# EAGLE design icetube_main (EAGLE 6.4)
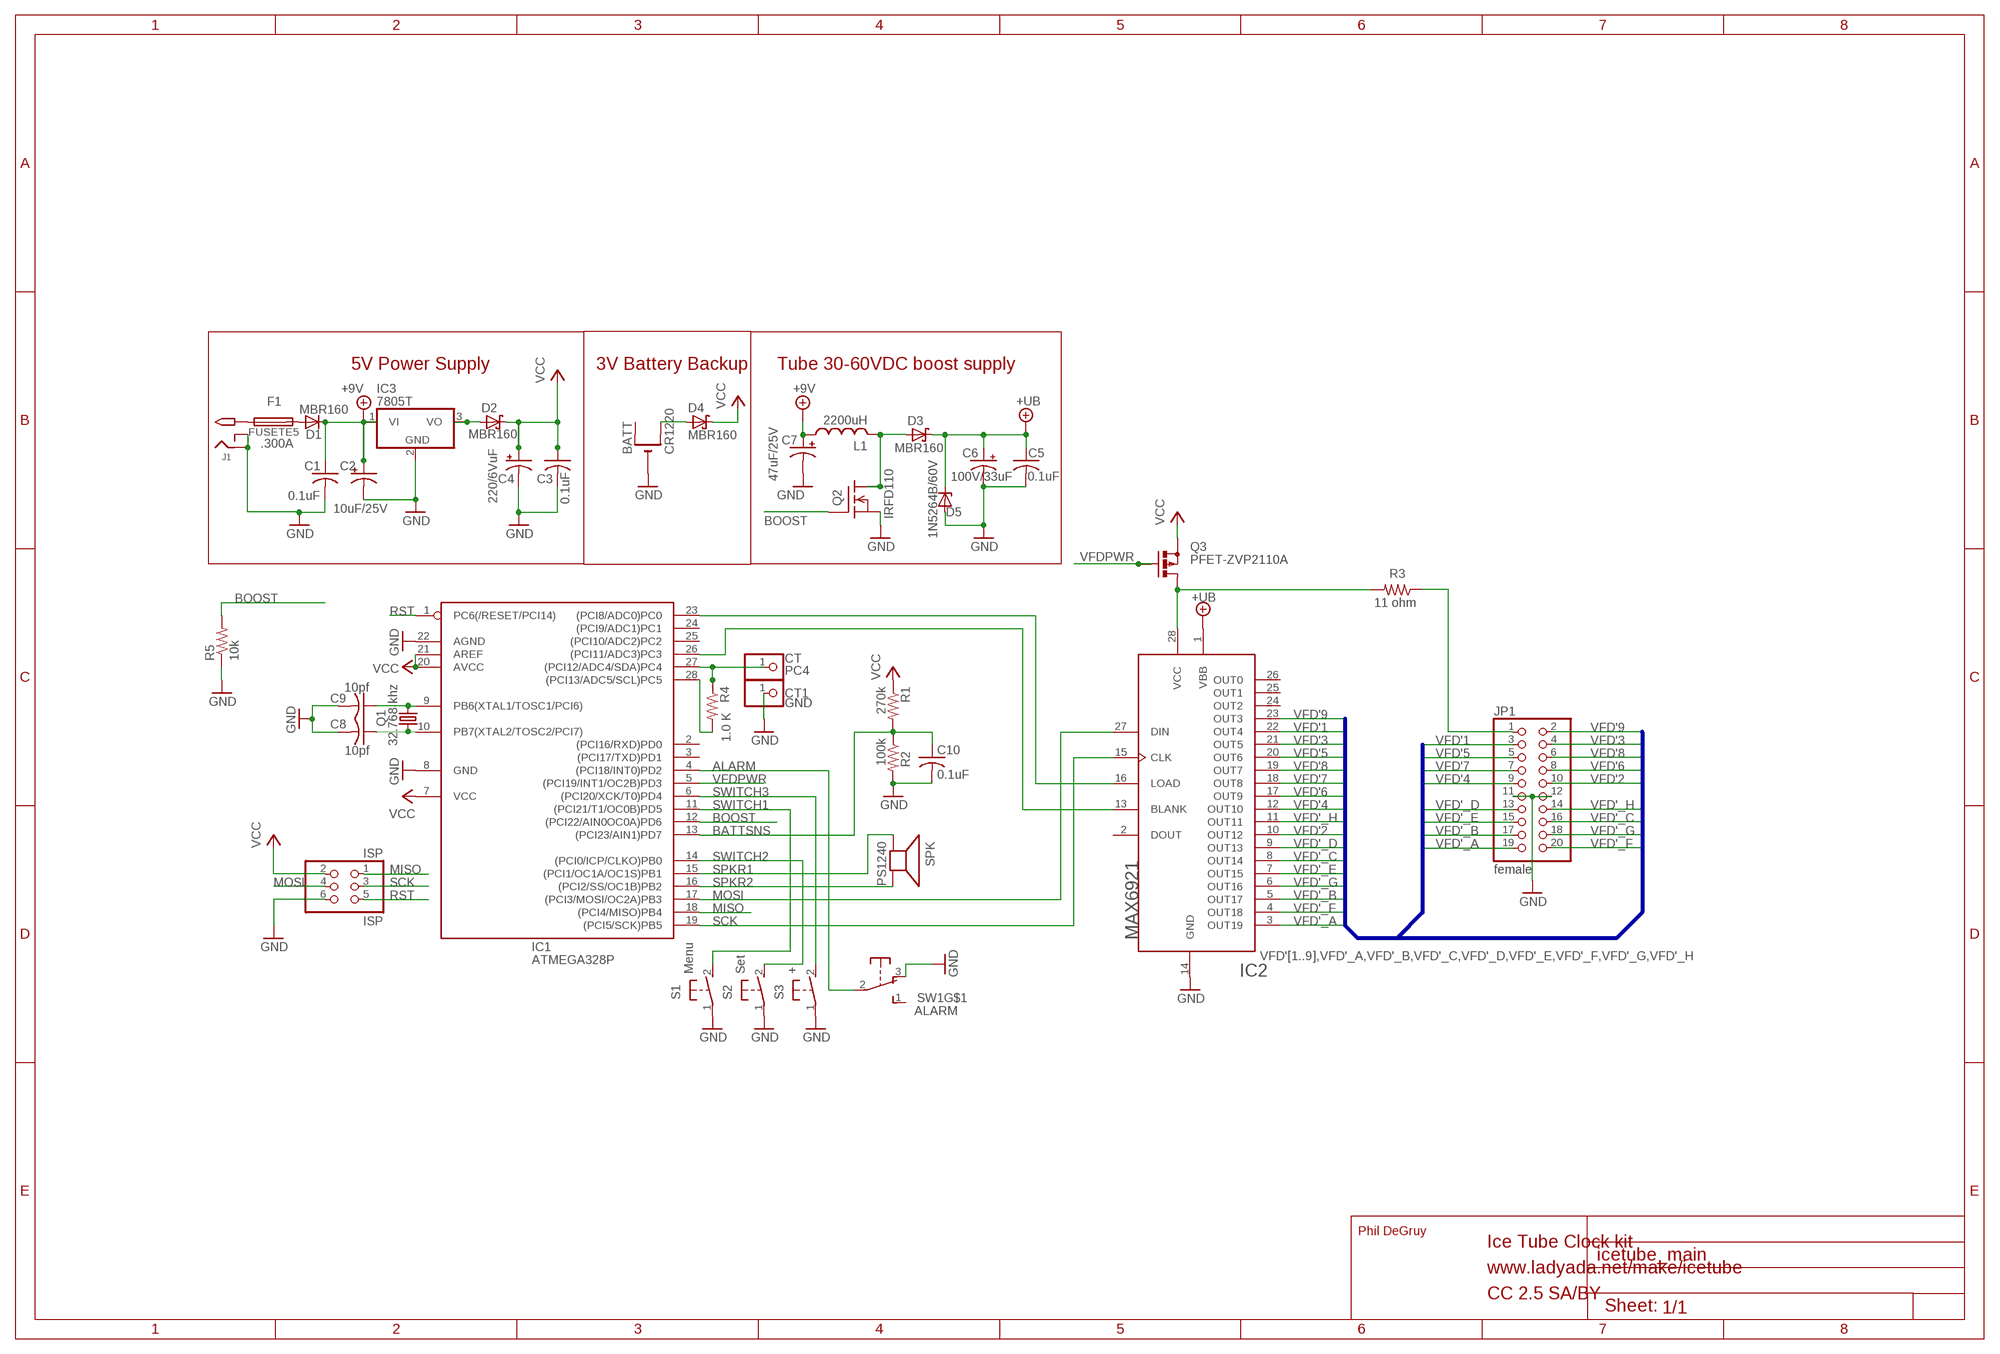
[diagram p0: schematic, sheet 1]

## Parts
BATT  CR1220  CR1220THM  [CR1220-THM]
C1  0.1uF  C-US025-025X050  [C025-025X050]
C2  10uF/25V  CPOL-USE2.5-6  [E2,5-6]
C3  0.1uF  C-US025-025X050  [C025-025X050]
C4  220/6VuF  CPOL-USE2.5-6  [E2,5-6]
C5  0.1uF  C-US025-024X044  [C025-024X044]
C6  100V/33uF  CPOL-USE3.5-8  [E3,5-8]
C7  47uF/25V  CPOL-USE2.5-6  [E2,5-6]
C8  10pf  C-US025-025X050  [C025-025X050]
C9  10pf  C-US025-025X050  [C025-025X050]
C10  0.1uF  C-US025-024X044  [C025-024X044]
CT  PC4  PINHD-1X1  [1X01]
CT1  GND  PINHD-1X1  [1X01]
D1  MBR160  1N4004  [DO41-10]
D2  MBR160  SCHOTTKY-DIODEDO41  [DO41-10]
D3  MBR160  SCHOTTKY-DIODEDO41  [DO41-10]
D4  MBR160  SCHOTTKY-DIODEDO41  [DO41-10]
D5  1N5264B/60V  ZENER-DIODEDO41Z10  [DO41Z10]
F1  FUSETE5  [TE5]
IC1  ATMEGA328P  ATMEGA168PROUND  [DIL28/3]
IC2  MAX6921  [PLCC-S28]
IC3  7805T  [TO220H]
ISP  ISP  PINHD-2X3  [2X03]
J1  2.1MMJACKTHM  [PJ-102A]
JP1  female  PINHD-2X10  [2X10]
L1  2200uH  L  [6000]
Q1  32.768 khz  CRYTALTC26V  [TC26V]
Q2  IRFD110  [DIL04]
Q3  PFET-ZVP2110A  PFETZVP3306  [TO92-OVAL]
R1  270k  R-US_0207/10  [0207/10]
R2  100k  R-US_0207/10  [0207/10]
R3  11 ohm  R-US_0207/10  [0207/10]
R4  1.0 K  R-US_0207/5V  [0207/5V]
R5  10k  R-US_0207/5V  [0207/5V]
S1  Menu  31-XX  [B3F-31XX]
S2  Set  31-XX  [B3F-31XX]
S3  +  31-XX  [B3F-31XX]
SPK  PS1240  SPEAKER/PS12  [PS12]
SW1  ALARM  OS102011MA1Q  [OS102011MA1Q]

## Nets
+9V: C1.1 C2.+ C7.+ D1.C IC3.1(VI) L1.1
+UB: C5.1 C6.+ D3.C D5.C IC2.1(VBB)
ALARM: IC1.4((PCI18/INT0)PD2) SW1.2(P)
BATTSNS: C10.1 IC1.13((PCI23/AIN1)PD7) R1.2 R2.1
BLANK: IC1.26((PCI11/ADC3)PC3) IC2.13(BLANK)
BOOST: IC1.12((PCI22/AIN0OC0A)PD6) Q2.3(G) R5.2
GND: BATT.- C1.2 C2.- C3.2 C4.- C5.2 C6.- C7.- C8.2 C9.2 C10.2 CT1.1 D5.A IC1.8(GND) IC1.22(AGND) IC2.14(GND) IC3.2(GND) ISP.6 J1.RING J1.RING_SW JP1.11 JP1.12 Q2.4(S) R2.2 R5.1 S1.1(P) S2.1(P) S3.1(P) SW1.3(O)
LOAD: IC1.23((PCI8/ADC0)PC0) IC2.16(LOAD)
MISO: IC1.18((PCI4/MISO)PB4) ISP.1
MOSI: IC1.17((PCI3/MOSI/OC2A)PB3) IC2.27(DIN) ISP.4
N$1: C9.1 IC1.9(PB6(XTAL1/TOSC1/PCI6)) Q1.2
N$2: D3.A L1.2 Q2.1(D) Q2.2(D1)
N$3: C8.1 IC1.10(PB7(XTAL2/TOSC2/PCI7)) Q1.1
N$4: F1.1 J1.TIP
N$5: D1.A F1.2
N$10: BATT.+2(+1) D4.A
N$11: IC1.28((PCI13/ADC5/SCL)PC5) R4.2
N$34: JP1.1 R3.1
N$39: IC2.28(VCC) Q3.3(D) R3.2
N$52: CT.1 IC1.27((PCI12/ADC4/SDA)PC4) R4.1
N$53: D2.A IC3.3(VO)
RST: IC1.1(PC6(/RESET/PCI14)) ISP.5
SCK: IC1.19((PCI5/SCK)PB5) IC2.15(CLK) ISP.3
SPKR1: IC1.15((PCI1/OC1A/OC1S)PB1) SPK.P$1(+)
SPKR2: IC1.16((PCI2/SS/OC1B)PB2) SPK.P$2(-)
SWITCH1: IC1.11((PCI21/T1/OC0B)PD5) S1.2(S)
SWITCH2: IC1.14((PCI0/ICP/CLKO)PB0) S2.2(S)
SWITCH3: IC1.6((PCI20/XCK/T0)PD4) S3.2(S)
VCC: C3.1 C4.+ D2.C D4.C IC1.7(VCC) IC1.20(AVCC) IC1.21(AREF) ISP.2 Q3.1(S) R1.1
VFD'1: IC2.22(OUT4) JP1.3
VFD'2: IC2.10(OUT12) JP1.10
VFD'3: IC2.21(OUT5) JP1.4
VFD'4: IC2.12(OUT10) JP1.9
VFD'5: IC2.20(OUT6) JP1.5
VFD'6: IC2.17(OUT9) JP1.8
VFD'7: IC2.18(OUT8) JP1.7
VFD'8: IC2.19(OUT7) JP1.6
VFD'9: IC2.23(OUT3) JP1.2
VFD'_A: IC2.3(OUT19) JP1.19
VFD'_B: IC2.5(OUT17) JP1.17
VFD'_C: IC2.8(OUT14) JP1.16
VFD'_D: IC2.9(OUT13) JP1.13
VFD'_E: IC2.7(OUT15) JP1.15
VFD'_F: IC2.4(OUT18) JP1.20
VFD'_G: IC2.6(OUT16) JP1.18
VFD'_H: IC2.11(OUT11) JP1.14
VFDPWR: IC1.5((PCI19/INT1/OC2B)PD3) Q3.2(G)
Unconnected: BATT.+1(+) IC1.2((PCI16/RXD)PD0) IC1.3((PCI17/TXD)PD1) IC1.24((PCI9/ADC1)PC1) IC1.25((PCI10/ADC2)PC2) IC2.2(DOUT) IC2.24(OUT2) IC2.25(OUT1) IC2.26(OUT0) SW1.1(S) SW1.MT1(MT) SW1.MT2(MT)

## Buses
VFD'[1..9],VFD'_A,VFD'_B,VFD'_C,VFD'_D,VFD'_E,VFD'_F,VFD'_G,VFD'_H

## Notes on the sheet
- 5V Power Supply | 3V Battery Backup | Tube 30-60VDC boost supply
- Ice Tube Clock kit
- www.ladyada.net/make/icetube
- CC 2.5 SA/BY

## Library data of the parts
BATT = adafruit:CR1220: CR1216/CR1220/CR1225 12mm 3V lithium coin cell Great for battery packup. Both SMT and THM holders. Note the THM package has the ground pads on both sides of the PCB so that the masks are the same - this reduces the cost
C1 C3 C8 C9 = minimidi:C-US: CAPACITOR, American symbol
C2 C4 C7 = minimidi:CPOL-US: POLARIZED CAPACITOR, American symbol
C5 C10 = rcl-ez:C-US: CAPACITOR, American symbol
C6 = rcl-ez:CPOL-US: POLARIZED CAPACITOR, American symbol
CT CT1 = ybox2:PINHD-1X1: PIN HEADER
D1 = minimidi:1N4004: DIODE general purpose rectifier, 1 A
D2-D4 = usbbuck:SCHOTTKY-DIODE: Schottky Diode
D5 = diode:ZENER-DIODE: Z-Diode
F1 = fuse:FUSE: Fuse; MF: .300A; OC_FARNELL: unknown; OC_NEWARK: unknown
IC1 = avr:ATMEGA168*P: MICROCONTROLLER 16 kBytes FLASH 1 kBytes SRAM 512 Bytes EEPROM USART 8-channel 10 bit ADC
IC2 = vfd:MAX6921
IC3 = linear:78*: Positive VOLTAGE REGULATOR Source: http://cache.national.com/ds/LM/LM78L05.pdf http://www.fairchildsemi.com/ds/LM/LM7805.pdf
ISP = pinhead-ez:PINHD-2X3: PIN HEADER
J1 = adafruit:2.1MMJACK: 2.1mm x 5.5mm THM DC jack with internal switch. Digikey part #PJ-102A, 4UCON part #05537 2.1mm x 5.5mm SMT DC jack with internal switch. Digikey part #PJ-002A-SMT, 4UCON part #03267 By microbuilder.eu & adafruit.com
JP1 = pinhead:PINHD-2X10: PIN HEADER
L1 = usbbuck:L
Q1 = crystal:CRYTAL: CRYSTAL
Q2 = vfd:IRFD110
Q3 = adafruit:PFET: P-CHANNEL MOS FET
R1-R5 = minimidi:R-US_: RESISTOR, American symbol
S1-S3 = switch-omron:31-XX: OMRON SWITCH; MPN: B3F-3100; OC_FARNELL: 959704; OC_NEWARK: 36M3582
SPK = ybox2:SPEAKER: SPEAKER Source: Buerklin
SW1 = adafruit:OS102011MA1Q: OS10201MA1Q through-hole right angle switch http://www.ladyada.net/library/eagle

## Board
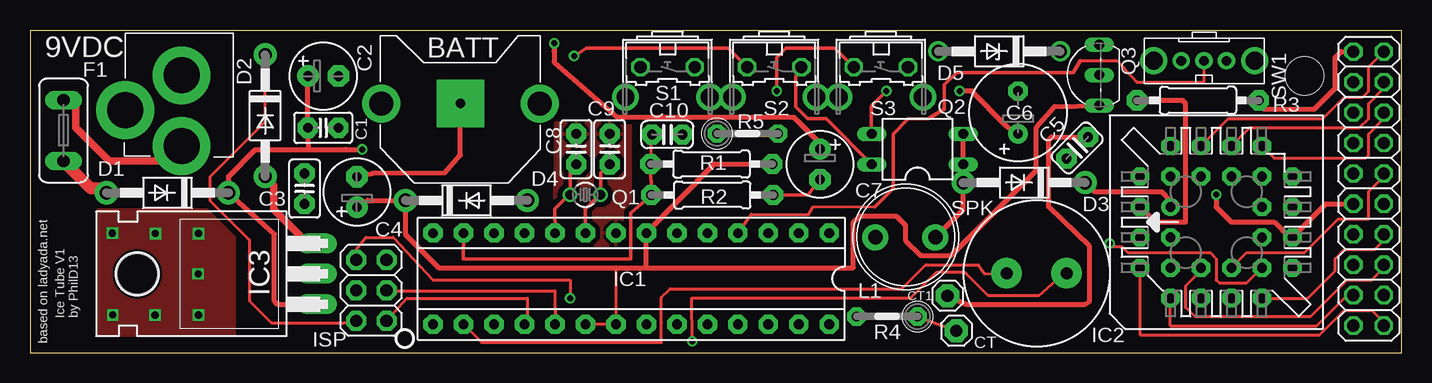
[diagram p1: board, top side]
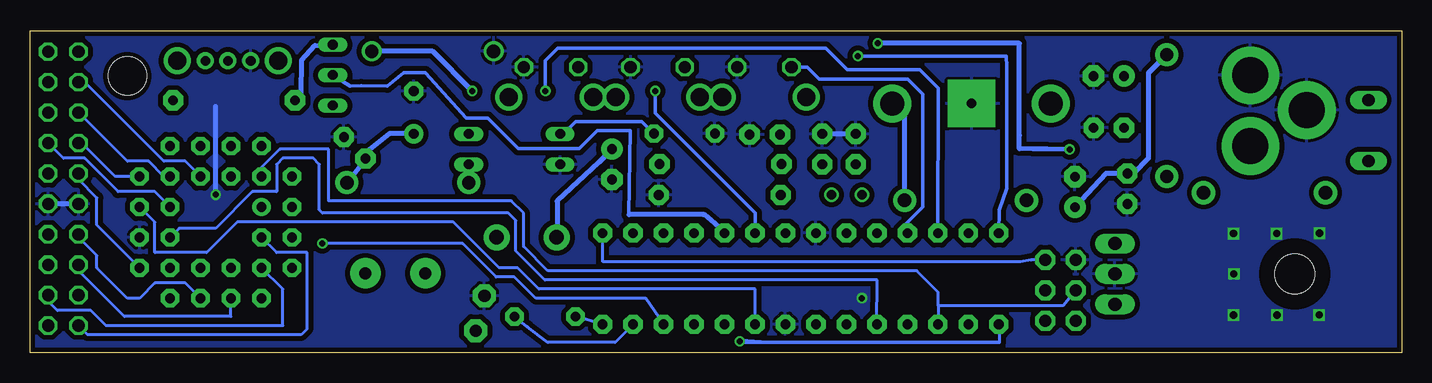
[diagram p2: board, bottom side, seen from below]

Size 114.33 x 26.86 mm. Coordinates in mm from the lower left corner, seen from the top.
Outline: 0,0.01 114.33,0
Outline: 114.33,0 114.33,26.86 0,26.86 0,0.01
Outline: 0,0.01 114.33,0
Copper layers (1*16): Top 0.0356mm / dielectric 1.5011mm / Bottom 0.0356mm
Design rules "osh_boards": minimum track width 6mil, minimum drill 13mil, track to track 6mil, track to pad 6mil, pad to pad 6mil, via to via 6mil, smd to smd 6mil, copper to edge 15mil, drill to drill 6mil, minimum pad ring 7mil, minimum via ring 7mil, stop-mask expansion 4mil, vias tented up to drill 0mil, thermal gap 10mil
Holes 3.2 mm at 106.22,23.09

### Footprints (pad centres in the part's own frame; a part is rotated, then mirrored left to right if it is on the bottom)
CR1220-THM = drill 2 pad 3.175: +1 -6.604,0; +2 6.604,0 | drill 0.8 pad 3.962 square: - 0,0
C025-025X050 = drill 0.813 pad 1.676 octagon: 1 -1.27,0; 2 1.27,0
E2,5-6 = drill 0.813 pad 1.778: + -1.27,0 | drill 0.813 pad 1.778 octagon: - 1.27,0
C025-024X044 = drill 0.813 pad 1.676 octagon: 1 -1.27,0; 2 1.27,0
E3,5-8 = drill 0.813 pad 1.6: + -1.778,0 | drill 0.813 pad 1.6 octagon: - 1.778,0
1X01 = drill 1.016 pad 1.93 octagon: 1 0,0
DO41-10 = drill 1.118 pad 1.93: A 5.08,0; C -5.08,0
DO41Z10 = drill 1.118: A 5.08,0; C -5.08,0
TE5 = drill 1.016 long: 1 -2.54,0; 2 2.54,0
DIL28/3 = drill 0.813 pad 1.6 octagon: 1 -16.51,-3.81; 2 -13.97,-3.81; 3 -11.43,-3.81; 4 -8.89,-3.81; 5 -6.35,-3.81; 6 -3.81,-3.81; 7 -1.27,-3.81; 8 1.27,-3.81; 9 3.81,-3.81; 10 6.35,-3.81; 11 8.89,-3.81; 12 11.43,-3.81; 13 13.97,-3.81; 14 16.51,-3.81; 15 16.51,3.81; 16 13.97,3.81; 17 11.43,3.81; 18 8.89,3.81; 19 6.35,3.81; 20 3.81,3.81; 21 1.27,3.81; 22 -1.27,3.81; 23 -3.81,3.81; 24 -6.35,3.81; 25 -8.89,3.81; 26 -11.43,3.81; 27 -13.97,3.81; 28 -16.51,3.81
PLCC-S28 = drill 0.813 pad 1.524: 1 1.27,3.81 | drill 0.813 pad 1.524 octagon: 2 -1.27,6.35; 3 -1.27,3.81; 4 -3.81,6.35; 5 -6.35,3.81; 6 -3.81,3.81; 7 -6.35,1.27; 8 -3.81,1.27; 9 -6.35,-1.27; 10 -3.81,-1.27; 11 -6.35,-3.81; 12 -3.81,-6.35; 13 -3.81,-3.81; 14 -1.27,-6.35; 15 -1.27,-3.81; 16 1.27,-6.35; 17 1.27,-3.81; 18 3.81,-6.35; 19 6.35,-3.81; 20 3.81,-3.81; 21 6.35,-1.27; 22 3.81,-1.27; 23 6.35,1.27; 24 3.81,1.27; 25 6.35,3.81; 26 3.81,6.35; 27 3.81,3.81; 28 1.27,6.35
TO220H = drill 1.118 long: 1 -2.54,-10.16; 2 0,-10.16; 3 2.54,-10.16 | hole 3.302: 0,4.826
2X03 = drill 1.016 pad 1.676 octagon: 1 -2.54,-1.27; 2 -2.54,1.27; 3 0,-1.27; 4 0,1.27; 5 2.54,-1.27; 6 2.54,1.27
PJ-102A = drill 3 pad 4.8: RING 0.1,-3.39; RING_SW -4.6,-6.29; TIP 0.1,-9.29
2X10 = drill 1.016 octagon: 1 -11.43,-1.27; 2 -11.43,1.27; 3 -8.89,-1.27; 4 -8.89,1.27; 5 -6.35,-1.27; 6 -6.35,1.27; 7 -3.81,-1.27; 8 -3.81,1.27; 9 -1.27,-1.27; 10 -1.27,1.27; 11 1.27,-1.27; 12 1.27,1.27; 13 3.81,-1.27; 14 3.81,1.27; 15 6.35,-1.27; 16 6.35,1.27; 17 8.89,-1.27; 18 8.89,1.27; 19 11.43,-1.27; 20 11.43,1.27
6000 = drill 1.2 pad 2.184: 1 -2.5,0; 2 2.5,0
TC26V = drill 0.813: 1 -1.27,0; 2 1.27,0
DIL04 = drill 0.813 long: 1 -1.27,-3.81; 2 1.27,-3.81; 3 1.27,3.81; 4 -1.27,3.81
TO92-OVAL = drill 0.813 long: 1 -2.54,0; 2 0,0; 3 2.54,0
0207/10 = drill 0.813 pad 1.676 octagon: 1 -5.08,0; 2 5.08,0
0207/5V = drill 0.813 pad 1.524 octagon: 1 -2.54,0; 2 2.54,0
B3F-31XX = drill 1.016 octagon: 1 -2.261,-1.245; 2 2.261,-1.245 | drill 1.499 pad 2.159: 3 -3.505,1.245; 4 3.505,1.245
PS12 = drill 1 pad 2.54: P$1 -2.5,0; P$2 2.5,0
OS102011MA1Q = drill 0.8 pad 1.422: 1 -1.873,0; 2 0,0; 3 1.9,0 | drill 1.5 pad 2.184: MT1 -4.227,0; MT2 4.2,0

### Placement (x,y rotation side)
BATT  35.86,20.8 0 top
C1  24.43,18.77 0 top
C2  24.43,23.09 0 top
C3  22.88,13.69 270 top
C4  27.25,13.42 90 top
C5  87.27,17.1 45 top
C6  82.34,20.04 90 top
C7  65.83,15.72 270 top
C8  45.51,16.99 90 top
C9  48.3,16.99 90 top
C10  53.1,18.21 0 top
CT  77.19,1.84 0 top
CT1  76.46,4.75 0 top
D1  11.45,13.35 180 top
D2  19.6,19.79 270 top
D3  82.85,14.2 180 top
D4  36.37,12.71 0 top
D5  80.77,25.15 180 top
F1  2.79,18.54 270 top
IC1  50.1,6.17 180 top
IC2  98.85,10.9 90 top
IC3  13.76,6.58 90 top
ISP  28.45,5.21 90 top
J1  12.54,26.54 0 top
JP1  111.55,13.69 270 top
L1  72.94,9.63 0 top
Q1  46.27,13.18 0 top
Q2  73.96,16.99 90 top
Q3  89.1,23.17 90 top
R1  56.79,15.75 180 top
R2  56.86,13.16 0 top
R3  97.33,21.06 180 top
R4  71.42,3.02 180 top
R5  59.8,18.29 0 top
S1  53.13,22.58 180 top
S2  62.02,22.58 180 top
S3  70.91,22.58 180 top
SPK  83.89,6.63 180 top
SW1  97.83,24.36 180 top

### Tracks (layer width: path | path; a pad name or v marks a point on that pad's centre or on a via)
+9V  (via drill 0.5)
  Top 0.406: C2.+ C1.1 23.22,16.97 | 23.22,16.97 26.31,16.97 v27.7,16.97 | IC3.1 20.62,4.04 20.36,4.29 20.36,9.88 D1.C 16.55,14.71 18.75,16.95 23.22,16.97 | 43.69,25.5 43.69,25.15 | 43.69,25.15 43.69,24.26 48.94,19.66 63.65,19.66 65.78,17.53 65.78,17.02 65.81,16.99 C7.+ | v43.69,25.82 43.69,25.78 43.69,25.15
  Bottom 0.254: 70.4,9.63 L1.1
  Bottom 0.406: C7.+ 66.35,16.45 66.93,15.88 70.4,12.65 70.4,9.63 | v27.7,16.97 29.59,17 30.77,17.01 31.87,17.02 31.87,18.16 31.87,25.82 v43.69,25.82
+UB  (via drill 0.5)
  Top 0.406: D3.C 88.69,13.44 94.28,13.44 95.04,12.68 IC2.1 | C6.+ 81.77,18.54 81.33,18.96 78.48,21.84 v77.47,21.84
  Bottom 0.254: 88.06,14.07 D3.C 87.67,14.45
  Bottom 0.305: C6.+ 82.37,18.29
  Bottom 0.406: 87.9,14.19 87.67,14.45 86.83,15.59 C5.1 86.28,16.74 84.35,18.29 82.37,18.29 | D5.C 80.77,25.15 v77.47,21.84
ALARM
  Top 0.254: 60.12,11.53 64.89,11.53 65.28,12.19 70.4,12.17 | 87.54,24.37 90.59,24.37 92.25,22.58 97.83,22.58 SW1.2 | 73.2,19.53 74.9,19.53 74.93,19.56
  Top 0.305: 73.2,19.53 71.93,18.26 71.93,13.69 70.4,12.17 | IC1.4 60.12,11.53 | 87.54,24.37 86.94,23.37 77.21,23.37 76.2,22.35 76.2,20.32 74.93,19.56
BATTSNS
  Top 0.254: C10.1 51.73,15.72 R1.2
  Top 0.305: IC1.13 36.11,7.85 50.08,7.85 50.08,11.66 51.86,13.18 R2.1 | R2.1 51.84,13.2 | R2.1 R1.2
BLANK  (via drill 0.5)
  Top 0.254: IC2.13 101.39,5.82 99.1,5.82 98.85,6.07 98.85,7.85 98.34,8.36 91.48,8.36 90.98,8.87 89.96,8.87 v89.96,9.12
  Bottom 0.254: IC1.26 63.04,4.55 72.18,4.55 73.96,6.33 75.48,6.33 78.28,9.12 v89.96,9.12
BOOST  (via drill 0.5)
  Top 0.305: Q2.3 70.1,18.22 70.1,18.29 70.1,20.57 v71.37,21.84
  Top 0.406: Q2.3 70.1,18.26 70.1,18.29
  Bottom 0.305: IC1.12 38.65,22.07 40.2,23.62 45.97,23.62 46.23,23.62 48,25.4 70.36,25.4 71.37,24.38 v71.37,21.84 | R5.2 63.35,19.3 68.83,19.3 69.85,18.29 70.12,18.29 Q2.3
GND  (via drill 0.5, 0.6)
  Top 0.254: IC1.22 51.35,2.77 | 64.31,23.83 S2.1 64.26,23.85 | v45,4.55 45,6.07 33.57,6.07 30.27,9.63 27.98,9.63 27.16,8.58 ISP.6
  Top 0.305: 64.26,23.85 64.05,23.85 64.05,23.34 63.8,23.09 63.8,20.55 64.81,19.53 66.34,19.53 Q2.4 | C7.- 65.81,14.45 65.78,14.48 64.85,13.17 R2.2
  Top 0.406: JP1.11 107.99,12.42 IC2.14 104.95,9.63 103.68,10.9 100.12,10.9 99.87,11.15 98.85,12.17 v98.85,13.18 | CT1.1 78.02,4.04 87.93,4.04 88.31,4.29 88.31,8.87 84.88,12.17 84.88,17.76 85.13,18.01 88.18,18.01 | 88.18,18.01 88.44,18.01 | 88.18,18.01 C5.2 | C4.- 28.49,14.96 28.77,15.03 34.56,15 35.86,16.49 BATT.-
  Bottom 0.406: 113.07,12.42 JP1.12 JP1.11 | v98.85,13.18 98.85,20.55 | C8.2 46.48,18.26 47.39,18.25 47.89,18.24 48.41,18.24
  other vias: 6.86,9.97 10.44,9.95 14.04,9.95 14.01,6.58 14.04,3.13 10.41,3.14 6.89,3.16
  pour Bottom (isolate 0.406): 0.14,26.77 0.14,0.1 114.22,0.1 114.22,26.77
  pour Top: 5.63,11.91 5.63,1.5 17.06,1.5 17.06,9.63 14.78,11.91
  pour Top (isolate 0.406): 43.81,19.18 43.69,8.89 50.04,9.02 50.04,19.18
LOAD
  Bottom 0.254: 105.45,12.42 IC2.16 103.93,10.9 103.93,8.36 99.61,8.36 97.07,10.9 79.04,10.9 75.23,7.09 73.7,7.09 71.93,5.31 53.89,5.31 IC1.23
MISO
  Top 0.254: IC1.18 41.45,3.02 41.45,4.55 31.4,4.55 ISP.1
MOSI
  Bottom 0.254: 38.65,3.91 IC1.17 | 38.65,3.91 38.65,5.06 40.43,6.83 71.16,6.83 73.2,8.87 73.2,11.66 74.21,12.68 89.45,12.68 89.45,16.99 93.52,16.99 95.04,15.47 IC2.27 | ISP.4 28.24,3.91 38.65,3.91
N$1
  Top 0.305: IC1.9 46.27,11.99 47.47,13.18 Q1.2 47.54,15.03 48.26,15.75 48.28,15.72 C9.1
N$2
  Top 0.406: L1.2 77.77,11.95 D3.A Q2.1 Q2.2
N$3
  Top 0.305: C8.1 45.49,15.72 45.46,15.75 45,15.29 Q1.1 44.98,13.18 44.96,13.21 43.73,11.99 IC1.10
N$4
  Top 0.61: J1.TIP 12,16 6.6,16 3.81,18.8 3.81,20.83 3.3,21.34 2.79,21.34 F1.1
N$5
  Top 1.016: D1.A 6.37,13.72 5.08,13.72 F1.2
N$10
  Bottom 0.406: BATT.+2 41.45,20.8 D4.A
N$11
  Bottom 0.254: IC1.28 R4.2
N$34
  Top 0.254: 102.38,21.08 102.36,21.08 102.36,20.83
  Top 0.406: JP1.1 109.26,25.12 108.76,24.61 108.76,22.07 107,20.32 102.87,20.32 102.36,20.83 | R3.1 102.38,21.08
N$39
  Top 0.406: IC2.28 93.77,10.9 96.31,10.9 96.31,20.8 96.06,21.06 R3.2
  Bottom 0.305: R3.2 91.74,21.57
  Bottom 0.406: 91.74,21.57 91.68,24.41 90.6,25.63 Q3.3
N$52
  Top 0.254: R4.1 74.48,2.83 CT.1
  Bottom 0.254: IC1.27 65.58,0.86 71.16,0.86 72.88,2.18 R4.1
N$53
  Top 0.61: IC3.3 23.14,9.12 20.32,11.94 20.32,13.97 19.6,14.69 D2.A
RST
  Bottom 0.254: 66.59,10.39 66.59,10.14 | 66.59,10.39 IC1.1 | 66.59,10.39 66.59,7.6 31.79,7.6 30.92,7.74 ISP.5
SCK
  Top 0.254: IC1.19 43.73,5.18 29.76,5.18 ISP.3
  Bottom 0.254: IC1.19 43.73,6.07 71.42,6.07 73.83,8.48 73.83,11.02 74.47,11.66 89.96,11.66 90.21,11.91 90.21,15.72 90.72,16.23 93.26,16.23 93.77,15.72 93.77,13.44 95.8,13.44 98.85,10.39 101.9,10.39 IC2.15
SPKR1  (via drill 0.5)
  Top 0.254: 86.4,6.83 SPK.P$1 86.28,6.71 84.12,4.8 79.8,4.8 78.02,6.58 78,6.58 77.85,6.73 75.56,6.73 73.4,4.57 55.16,4.57 v55.18,0.95
  Bottom 0.254: 33.57,0.86 33.57,1.75 IC1.15 | 55.12,1.02 52.8,0.86 v55.18,0.95
  Bottom 0.305: v55.18,0.95 55.27,0.99 55.24,0.89 52.8,0.86 51.53,0.86 33.57,0.86
SPKR2
  Top 0.254: IC1.16 37.64,0.86 52.62,0.86 52.62,2.52 52.62,4.55 52.6,4.55 52.58,4.57 53.34,5.33 72.64,5.33 74.65,7.34 79.04,7.34 79.55,6.58 SPK.P$2
SWITCH1
  Bottom 0.305: 41.19,10.9 39.92,12.17 39.92,21.57 41.19,22.84 48.56,22.84 49.55,23.83 S1.2 | IC1.11 41.19,10.9 | 41.19,10.9 41.45,10.64
SWITCH2  (via drill 0.5)
  Top 0.305: S2.2 58.19,25.4 46.48,25.4 46.35,25.4 v45.34,24.77
  Bottom 0.305: IC1.14 33.57,11.91 32.94,13.69 32.94,23.85 32.96,24.77 v45.34,24.77
SWITCH3  (via drill 0.5)
  Top 0.305: S3.2 67.08,25.4 62.99,25.4 62.23,24.64 v62.23,21.84
  Bottom 0.305: IC1.6 53.89,11.66 54.4,12.17 62.01,19.78 62.23,19.99 v62.23,21.84 62.48,21.84
VCC
  Top 0.254: IC1.20 IC1.21 48.81,7.09 | ISP.2 26.21,2.52 20.11,2.52 18.33,4.29 18.33,9.37 15.03,12.68 15.03,14.71 19.6,19.28 D2.C
  Top 0.305: 34.08,7.09 34.06,7.09 34.03,7.11
  Top 0.406: 51.35,7.09 IC1.7 57.01,15.76 R1.1 | 51.35,7.09 48.81,7.09 34.08,7.09 | 51.35,7.09 68.62,7.09 68.62,10.9 69.13,11.41 72.18,11.41 72.94,10.64 72.94,9.37 74.21,8.1 76.75,8.1 83.86,15.22 83.86,18.77 85.39,20.55 Q3.1 | 34.03,7.11 31.29,9.86 D4.C 28.12,12.72 C4.+
  Bottom 0.254: 51.43,10.05 51.37,10.08
  Bottom 0.406: IC1.7 51.43,10.05 | C4.+ 24.68,14.96 C3.1 22.4,14.96 21.13,16.23 21.13,23.34 D2.C
VFD'1
  Bottom 0.254: IC2.22 101.39,15.98 103.17,15.98 109.77,22.58 JP1.3
VFD'2
  Top 0.254: IC2.10 101.39,8.36 106.22,8.36 109.01,11.15 111.55,11.15 111.55,13.44 112.57,14.45 112.57,14.96 JP1.10
VFD'3
  Top 0.254: IC2.21 101.64,18.77 110.79,18.77 111.55,19.53 111.55,20.8 112.82,22.07 JP1.4
VFD'4
  Bottom 0.254: IC2.12 108.76,10.64 108.76,12.93 110.28,14.45 JP1.9
VFD'5
  Bottom 0.254: JP1.5 106.22,15.98 104.44,15.98 103.17,14.71 IC2.20
VFD'6
  Bottom 0.254: IC2.17 103.93,13.44 106.98,13.44 109.77,16.23 111.55,16.23 JP1.8 113.07,17.5
VFD'7
  Bottom 0.254: IC2.18 107.23,14.71 110.03,17.5 JP1.7
VFD'8
  Top 0.254: IC2.19 103.68,16.23 111.3,16.23 111.55,16.49 111.55,18.26 112.82,19.53 JP1.6
VFD'9
  Top 0.254: IC2.23 99.87,19.53 107.74,19.53 109.52,21.31 111.04,21.31 111.55,21.82 111.55,23.85 JP1.2
VFD'_A
  Bottom 0.254: JP1.19 109.52,1.5 91.74,1.5 91.23,2.01 91.23,8.36 93.77,8.36 IC2.3
VFD'_B
  Top 0.254: IC2.5 95.04,2.26 107.23,2.26 109.77,4.8 JP1.17
VFD'_C
  Top 0.254: IC2.8 97.58,6.83 96.31,5.56 96.31,3.79 97.07,3.02 106.72,3.02 109.77,6.07 111.8,6.07 112.82,7.09 JP1.16
VFD'_D
  Bottom 0.254: IC2.9 101.39,5.82 103.93,5.82 105.2,4.55 106.22,4.55 108.76,7.09 108.76,8.1 110.53,9.88 JP1.13
VFD'_E
  Bottom 0.254: IC2.7 97.58,3.02 106.47,3.02 110.28,6.83 JP1.15
VFD'_F
  Top 0.254: IC2.4 92.5,1.5 107.49,1.5 109.52,3.53 111.8,3.53 112.57,2.77 112.57,2.52 JP1.20
VFD'_G
  Bottom 0.254: IC2.6 93.26,5.31 93.26,2.26 107.99,2.26 109.26,3.53 112.06,3.53 112.82,4.29 JP1.18
VFD'_H
  Top 0.254: IC2.11 106.47,4.55 108.76,6.83 108.76,7.85 109.52,8.61 112.06,8.61 112.82,9.37 JP1.14
VFDPWR
  Bottom 0.305: 64.42,11.53 64.29,18.52 67.08,18.52 68.58,17.02 73.66,17.02 76.2,19.56 77.98,19.56 81.4,23.39 83.17,23.39 84.55,22.25 86.74,22.27 87.62,22.25 88.32,22.65 88.79,22.98 88.77,22.96 89,23.11 | 89,23.11 89.08,23.18 | 89,23.11 Q3.2
  Bottom 0.406: 64.42,11.53 58.21,11.53 58.14,11.53 57.27,10.8 56.41,10.01 IC1.5

### Text on the board
tPlace: 9VDC | Ice Tube V1 / by PhilD13 | based on ladyada.net